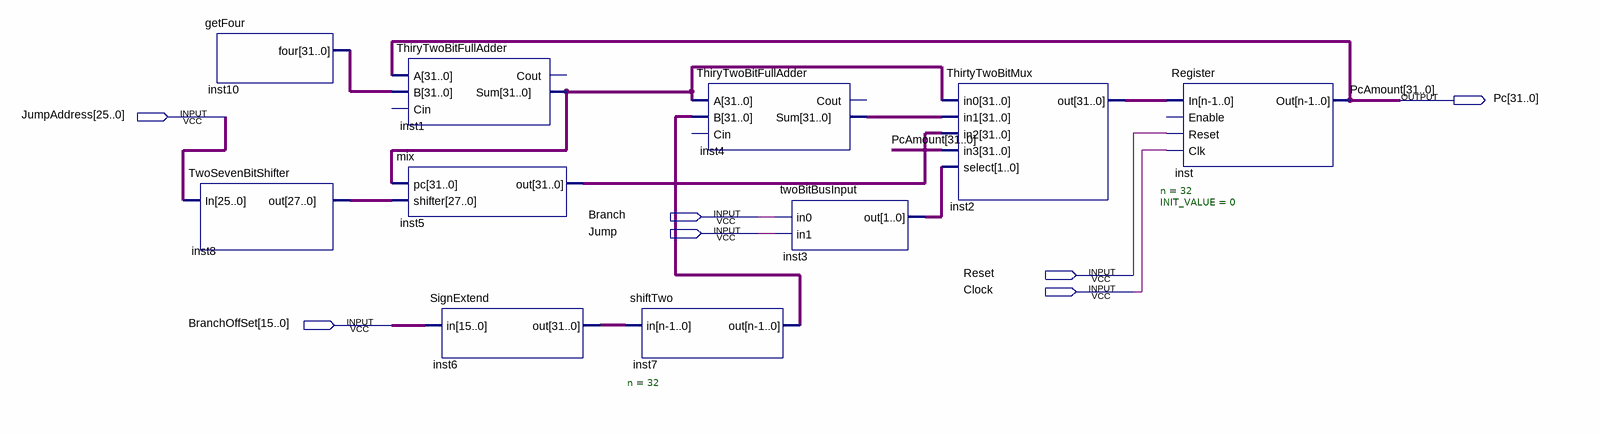
[diagram p0: schematic sheet]
// Quartus schematic PcCounter.bdf as structural Verilog: 10 symbols, 7 pins
module PcCounter (
  input  [25:0] JumpAddress,
  input  Branch,
  input  Jump,
  input  Reset,
  input  Clock,
  input  [15:0] BranchOffSet,
  output [31:0] Pc
);

  wire [1:0] inst3_out;
  wire [27:0] inst8_out;
  wire [31:0] inst1_sum, inst2_out, inst4_sum, inst5_out, inst6_out, inst7_out, inst10_four;

  getFour inst10 (.four(inst10_four));
  TwoSevenBitShifter inst8 (.In(JumpAddress), .out(inst8_out));
  ThiryTwoBitFullAdder inst1 (.A(Pc), .B(inst10_four), .Sum(inst1_sum));  // open: Cin, Cout
  mix inst5 (.pc(inst1_sum), .shifter(inst8_out), .out(inst5_out));
  SignExtend inst6 (.in(BranchOffSet), .out(inst6_out));
  shiftTwo #(.n(32)) inst7 (.in(inst6_out), .out(inst7_out));
  ThiryTwoBitFullAdder inst4 (.A(inst1_sum), .B(inst7_out), .Sum(inst4_sum));  // open: Cin, Cout
  twoBitBusInput inst3 (.in0(Branch), .in1(Jump), .out(inst3_out));
  ThirtyTwoBitMux inst2 (
    .in0(inst1_sum), .in1(inst4_sum), .in2(inst5_out), .in3(Pc), .select(inst3_out), .out(inst2_out));
  Register #(.n(32), .INIT_VALUE(0)) inst (.In(inst2_out), .Reset(Reset), .Clk(Clock), .Out(Pc));  // open: Enable

  // Other names for the same wires on the sheet: PcAmount[31:0] = Pc
endmodule
